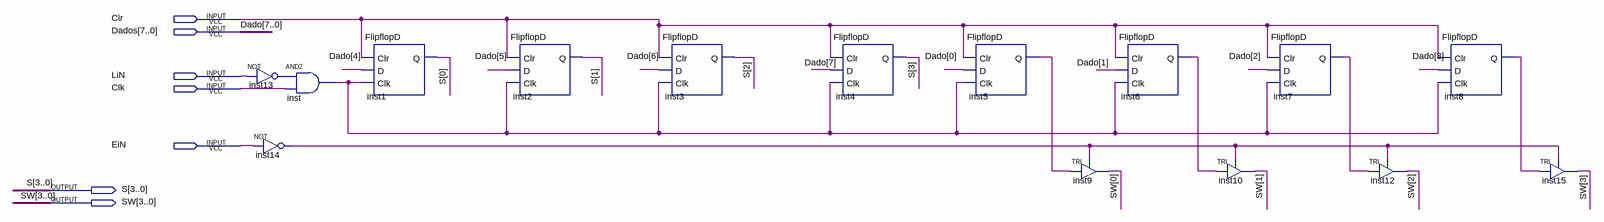
[diagram p0: schematic sheet]
// Quartus schematic register_inst.bdf as structural Verilog: 15 symbols, 7 pins
module register_inst (
  input  Clr,
  input  [7:0] Dados,
  input  LiN,
  input  Clk,
  input  EiN,
  output [3:0] S,
  output [3:0] SW
);

  wire inst5_q, inst6_q, inst7_q, inst8_q, inst13_out, inst14_out, inst_out;

  and inst (inst_out, inst13_out, Clk);
  not inst13 (inst13_out, LiN);
  not inst14 (inst14_out, EiN);
  FlipflopD inst1 (.Clr(Clr), .D(Dados[4]), .Clk(inst_out), .Q(S[0]));
  FlipflopD inst2 (.Clr(Clr), .D(Dados[5]), .Clk(inst_out), .Q(S[1]));
  FlipflopD inst3 (.Clr(Clr), .D(Dados[6]), .Clk(inst_out), .Q(S[2]));
  FlipflopD inst4 (.Clr(Clr), .D(Dados[7]), .Clk(inst_out), .Q(S[3]));
  FlipflopD inst5 (.Clr(Clr), .D(Dados[0]), .Clk(inst_out), .Q(inst5_q));
  TRI inst9 (.IN(inst5_q), .OE(inst14_out), .OUT(SW[0]));
  FlipflopD inst6 (.Clr(Clr), .D(Dados[1]), .Clk(inst_out), .Q(inst6_q));
  TRI inst10 (.IN(inst6_q), .OE(inst14_out), .OUT(SW[1]));
  FlipflopD inst7 (.Clr(Clr), .D(Dados[2]), .Clk(inst_out), .Q(inst7_q));
  TRI inst12 (.IN(inst7_q), .OE(inst14_out), .OUT(SW[2]));
  FlipflopD inst8 (.Clr(Clr), .D(Dados[3]), .Clk(inst_out), .Q(inst8_q));
  TRI inst15 (.IN(inst8_q), .OE(inst14_out), .OUT(SW[3]));

  // Other names for the same wires on the sheet: Dado[7:0] = Dados
endmodule
